# EAGLE design main_clock_board (EAGLE 8.2.1)
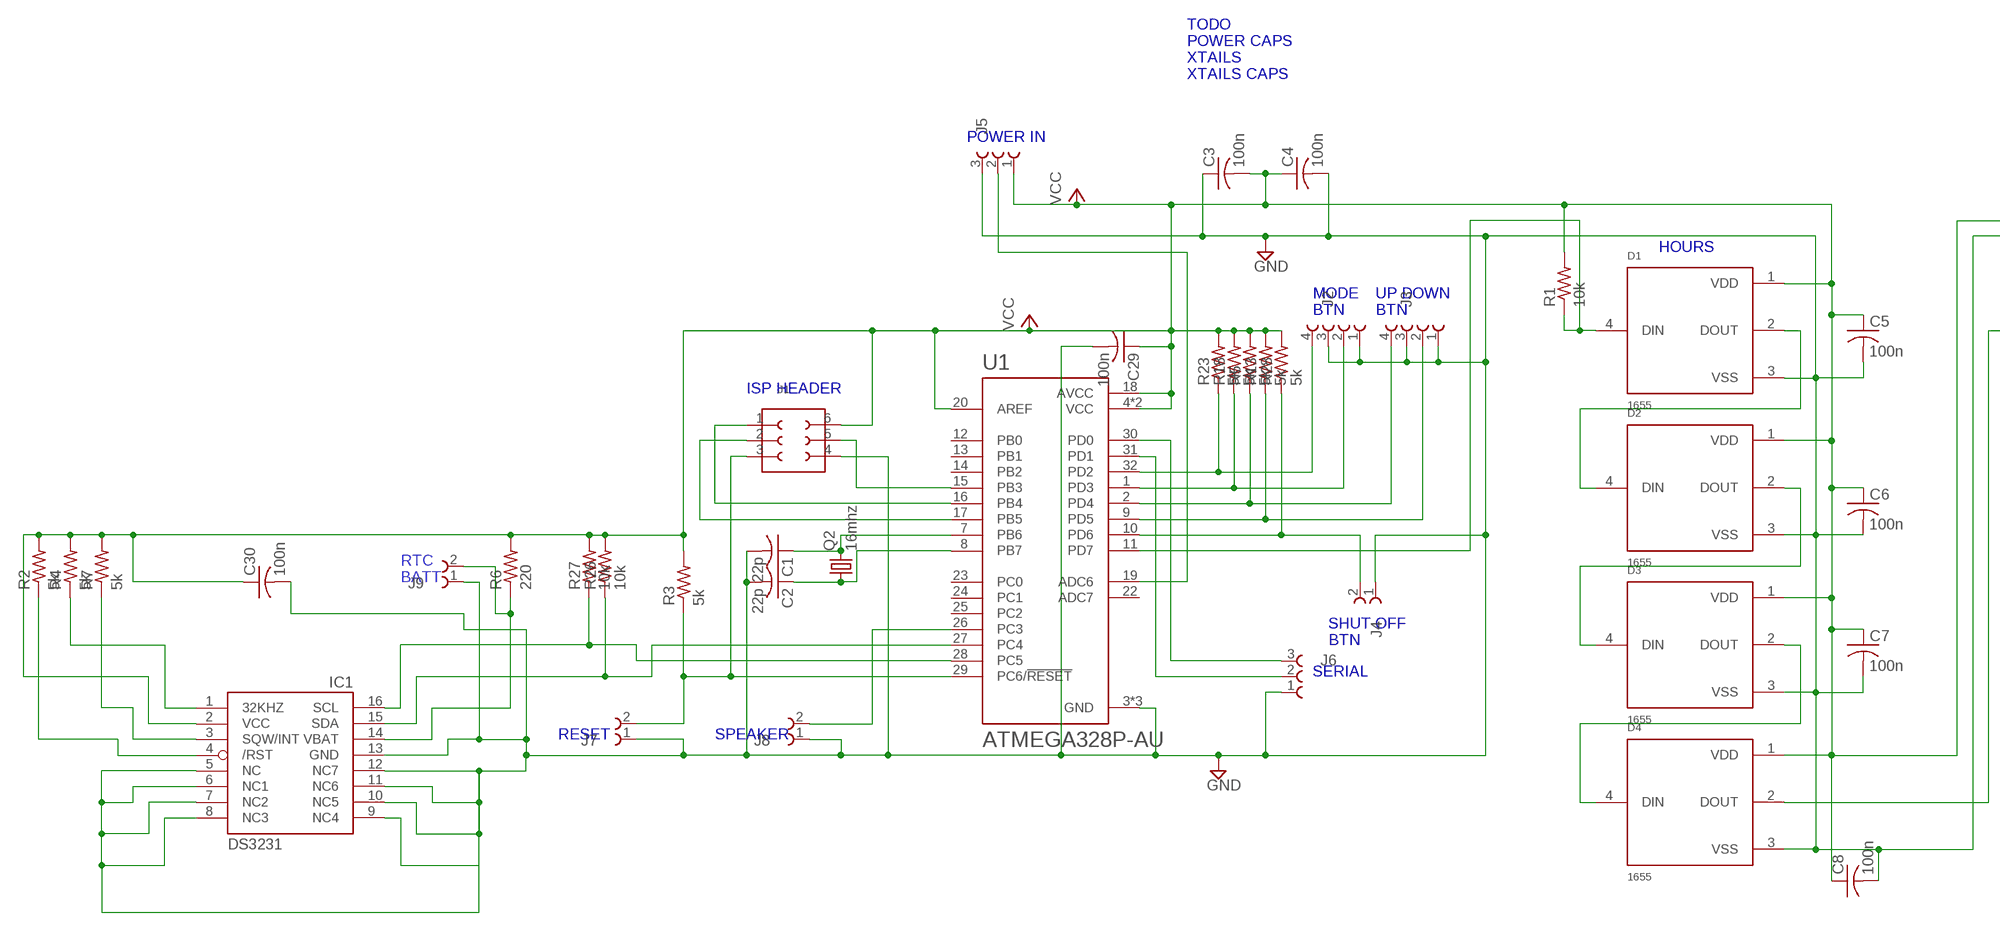
[diagram p0: schematic, sheet 1, part 1 of 2]
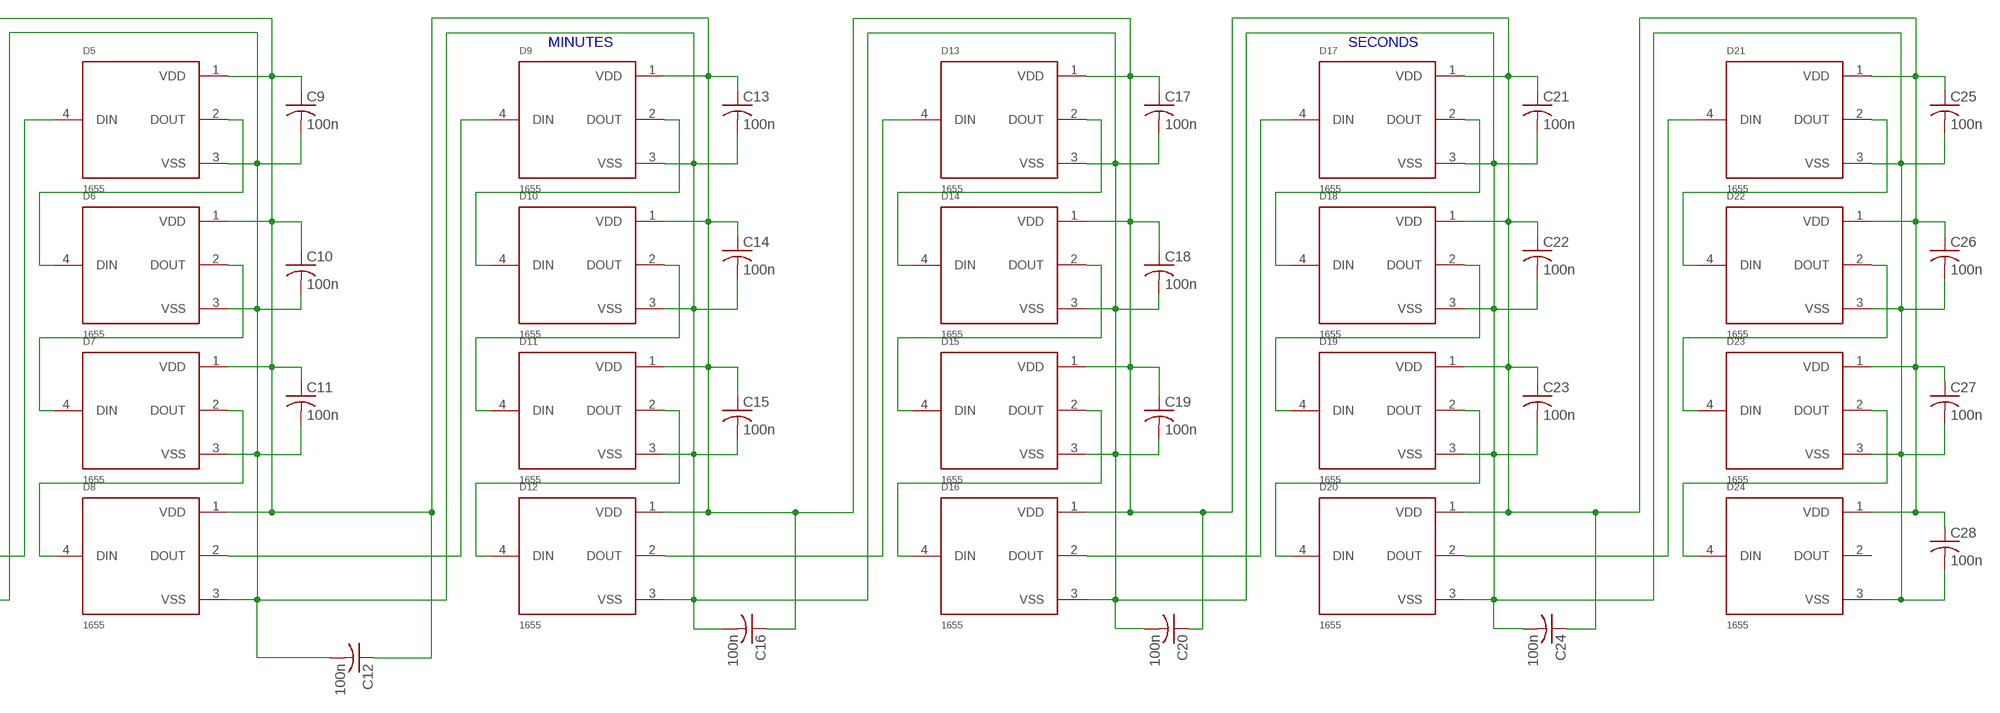
[diagram p1: schematic, sheet 1, part 2 of 2]

## Parts
C1  22p  C-USC0603  [C0603]
C2  22p  C-USC0603  [C0603]
C3  100n  C-US025-024X044  [C025-024X044]
C4  100n  C-US025-024X044  [C025-024X044]
C5  100n  C-US025-024X044  [C025-024X044]
C6  100n  C-US025-024X044  [C025-024X044]
C7  100n  C-US025-024X044  [C025-024X044]
C8  100n  C-US025-024X044  [C025-024X044]
C9  100n  C-US025-024X044  [C025-024X044]
C10  100n  C-US025-024X044  [C025-024X044]
C11  100n  C-US025-024X044  [C025-024X044]
C12  100n  C-US025-024X044  [C025-024X044]
C13  100n  C-US025-024X044  [C025-024X044]
C14  100n  C-US025-024X044  [C025-024X044]
C15  100n  C-US025-024X044  [C025-024X044]
C16  100n  C-US025-024X044  [C025-024X044]
C17  100n  C-US025-024X044  [C025-024X044]
C18  100n  C-US025-024X044  [C025-024X044]
C19  100n  C-US025-024X044  [C025-024X044]
C20  100n  C-US025-024X044  [C025-024X044]
C21  100n  C-US025-024X044  [C025-024X044]
C22  100n  C-US025-024X044  [C025-024X044]
C23  100n  C-US025-024X044  [C025-024X044]
C24  100n  C-US025-024X044  [C025-024X044]
C25  100n  C-US025-024X044  [C025-024X044]
C26  100n  C-US025-024X044  [C025-024X044]
C27  100n  C-US025-024X044  [C025-024X044]
C28  100n  C-US025-024X044  [C025-024X044]
C29  100n  C-US025-024X044  [C025-024X044]
C30  100n  C-US025-024X044  [C025-024X044]
D1  1655  [FCI_1655]
D2  1655  [FCI_1655]
D3  1655  [FCI_1655]
D4  1655  [FCI_1655]
D5  1655  [FCI_1655]
D6  1655  [FCI_1655]
D7  1655  [FCI_1655]
D8  1655  [FCI_1655]
D9  1655  [FCI_1655]
D10  1655  [FCI_1655]
D11  1655  [FCI_1655]
D12  1655  [FCI_1655]
D13  1655  [FCI_1655]
D14  1655  [FCI_1655]
D15  1655  [FCI_1655]
D16  1655  [FCI_1655]
D17  1655  [FCI_1655]
D18  1655  [FCI_1655]
D19  1655  [FCI_1655]
D20  1655  [FCI_1655]
D21  1655  [FCI_1655]
D22  1655  [FCI_1655]
D23  1655  [FCI_1655]
D24  1655  [FCI_1655]
IC1  DS3231/SO  [SO16W]
J1  610X0621121  [610X0621121]
J2  61300411121  [61300411121]
J3  61300411121  [61300411121]
J4  61300211121  [61300211121]
J5  61300311121  [61300311121]
J6  61300311121  [61300311121]
J7  61300211121  [61300211121]
J8  61300211121  [61300211121]
J9  61300211121  [61300211121]
Q2  16mhz  CRYSTALHC49S  [HC49/S]
R1  10k  R-US_R0603  [R0603]
R2  5k  R-US_R0603  [R0603]
R3  5k  R-US_R0603  [R0603]
R4  5k  R-US_R0603  [R0603]
R5  5k  R-US_R0603  [R0603]
R6  220  R-US_R0603  [R0603]
R7  5k  R-US_R0603  [R0603]
R13  5k  R-US_R0603  [R0603]
R18  5k  R-US_R0603  [R0603]
R23  5k  R-US_R0603  [R0603]
R26  10k  R-US_R0603  [R0603]
R27  10k  R-US_R0603  [R0603]
R28  5k  R-US_R0603  [R0603]
U1  ATMEGA328P-AU  [QFP80P900X900X120-32N]

## Nets
GND: C1.2 C2.2 C3.1 C4.2 C5.2 C6.2 C7.2 C8.2 C9.2 C10.2 C11.2 C12.2 C13.2 C14.2 C15.2 C16.2 C17.2 C18.2 C19.2 C20.2 C21.2 C22.2 C23.2 C24.2 C25.2 C26.2 C27.2 C28.2 C29.2 C30.2 D1.3(VSS) D2.3(VSS) D3.3(VSS) D4.3(VSS) D5.3(VSS) D6.3(VSS) D7.3(VSS) D8.3(VSS) D9.3(VSS) D10.3(VSS) D11.3(VSS) D12.3(VSS) D13.3(VSS) D14.3(VSS) D15.3(VSS) D16.3(VSS) D17.3(VSS) D18.3(VSS) D19.3(VSS) D20.3(VSS) D21.3(VSS) D22.3(VSS) D23.3(VSS) D24.3(VSS) IC1.5(NC) IC1.6(NC1) IC1.7(NC2) IC1.8(NC3) IC1.9(NC4) IC1.10(NC5) IC1.11(NC6) IC1.12(NC7) IC1.13(GND) J1.4 J2.1 J2.3 J3.1 J3.3 J4.1 J5.3 J6.1 J7.1 J8.1 J9.1 U1.3(GND) U1.5(GND) U1.21(GND)
N$1: D1.2(DOUT) D2.4(DIN)
N$2: IC1.15(SDA) R26.1 U1.27(PC4)
N$4: D2.2(DOUT) D3.4(DIN)
N$5: D3.2(DOUT) D4.4(DIN)
N$6: D4.2(DOUT) D5.4(DIN)
N$7: D5.2(DOUT) D6.4(DIN)
N$8: D6.2(DOUT) D7.4(DIN)
N$9: D7.2(DOUT) D8.4(DIN)
N$10: IC1.16(SCL) R27.1 U1.28(PC5)
N$11: J1.3 J7.2 R3.1 U1.29(PC6/!RESET)
N$12: D8.2(DOUT) D9.4(DIN)
N$13: D9.2(DOUT) D10.4(DIN)
N$14: J1.1 U1.16(PB4)
N$15: IC1.4(/RST) R2.1
N$16: D10.2(DOUT) D11.4(DIN)
N$17: D11.2(DOUT) D12.4(DIN)
N$18: D12.2(DOUT) D13.4(DIN)
N$19: D13.2(DOUT) D14.4(DIN)
N$20: D14.2(DOUT) D15.4(DIN)
N$21: D15.2(DOUT) D16.4(DIN)
N$23: J2.4 R23.1 U1.32(PD2)
N$24: D16.2(DOUT) D17.4(DIN)
N$25: D17.2(DOUT) D18.4(DIN)
N$26: J1.2 U1.17(PB5)
N$27: J2.2 R18.1 U1.1(PD3)
N$28: D18.2(DOUT) D19.4(DIN)
N$29: D19.2(DOUT) D20.4(DIN)
N$30: D20.2(DOUT) D21.4(DIN)
N$31: D21.2(DOUT) D22.4(DIN)
N$32: D22.2(DOUT) D23.4(DIN)
N$33: D23.2(DOUT) D24.4(DIN)
N$34: J3.4 R5.1 U1.2(PD4)
N$35: J3.2 R13.1 U1.9(PD5)
N$36: D1.4(DIN) R1.1 U1.11(PD7)
N$37: J4.2 R28.1 U1.10(PD6)
N$38: J1.5 U1.15(PB3)
N$39: J6.2 U1.31(PD1)
N$40: J6.3 U1.30(PD0)
N$41: J5.2 U1.19(ADC6)
N$42: J8.2 U1.26(PC3)
N$43: IC1.1(32KHZ) R4.1
N$44: IC1.14(VBAT) J9.2 R6.1
N$45: IC1.3(SQW/INT) R7.1
N$46: C1.1 Q2.2 U1.7(PB6)
N$47: C2.1 Q2.1 U1.8(PB7)
VCC: C3.2 C4.1 C5.1 C6.1 C7.1 C8.1 C9.1 C10.1 C11.1 C12.1 C13.1 C14.1 C15.1 C16.1 C17.1 C18.1 C19.1 C20.1 C21.1 C22.1 C23.1 C24.1 C25.1 C26.1 C27.1 C28.1 C29.1 C30.1 D1.1(VDD) D2.1(VDD) D3.1(VDD) D4.1(VDD) D5.1(VDD) D6.1(VDD) D7.1(VDD) D8.1(VDD) D9.1(VDD) D10.1(VDD) D11.1(VDD) D12.1(VDD) D13.1(VDD) D14.1(VDD) D15.1(VDD) D16.1(VDD) D17.1(VDD) D18.1(VDD) D19.1(VDD) D20.1(VDD) D21.1(VDD) D22.1(VDD) D23.1(VDD) D24.1(VDD) IC1.2(VCC) J1.6 J5.1 R1.2 R2.2 R3.2 R4.2 R5.2 R6.2 R7.2 R13.2 R18.2 R23.2 R26.2 R27.2 R28.2 U1.4(VCC) U1.6(VCC) U1.18(AVCC) U1.20(AREF)
Unconnected: D24.2(DOUT) U1.12(PB0) U1.13(PB1) U1.14(PB2) U1.22(ADC7) U1.23(PC0) U1.24(PC1) U1.25(PC2)

## Notes on the sheet
- TODO
  POWER CAPS
  XTAILS
  XTAILS CAPS
- POWER IN
- HOURS | MINUTES | SECONDS
- MODE
  BTN
- UP DOWN
  BTN
- ISP HEADER
- RTC
  BATT
- SHUT OFF
  BTN
- SERIAL
- RESET | SPEAKER

## Library data of the parts
C1-C30 = adafruit:C-US: CAPACITOR, American symbol
D1-D24 = 1655:1655: Ws2812b 5050 Rgb Led With Integrated Driver Chip Pack Of 10; AVAILABILITY: Good; DESCRIPTION: Ws2812b 5050 Rgb Led With Integrated Driver Chip Pack Of 10; MF: Adafruit Industries; MP: 1655; PACKAGE: None; PRICE: 4.16 USD
IC1 = DS3231_so16w:DS3231: The DS3231 is a low-cost, extremely accurate I²C real-time clock (RTC) with an integrated temperature-compensated crystal oscillator (TCXO) and crystal. The device incorporates a battery input, and maintains accurate timekeeping when main power to the device is interrupted.; AVAILABILITY: Unavailable; MF: Maxim Integrated; MP: DS3231; PACKAGE: None; PRICE: None
J1 = Wurth_Elektronik_Electromechanic_Board_to_Board_Connectors_rev16c:610X0621121: WR-PHD 2.54mm Dual SMT Pin Header, 6 Pins =>Code : Con_BTB_PHD_2.54_2_610x0621121(packageing:x = 0: Tube x = 3: Tape & Reel with Cap; 300 pcs/Reel) <http://katalog.we-online.de/media/images/eican/Con_BTB_PHD_2.54_2_6100xx21121_pf2.jpg> 6100xx21121 Details see: http://katalog.we-online.de/en/em/610_0xx_211_21 6103xx21121 Details see: http://katalog.we-online.de/en/em/PHD_2_54_SMT_DUAL_PIN_HEADER_REEL_6103XX21121 2014 (C) Würth Elektronik
J2 J3 = Wurth_Elektronik_Electromechanic_Board_to_Board_Connectors_rev16c:61300411121: WR-PHD 2.54mm Pin Header, 4 Pin =>Code : Con_BTB_PHD_2.54_1_THT_61300411121 <http://katalog.we-online.de/media/images/eican/Con_BTB_PHD_2.54_1_THT_6130xx11121_pf2.jpg> Details see: http://katalog.we-online.de/en/em/613_0xx_111_21 Created 2014-05-29, Karrer Zheng 2014 (C) Würth Elektronik
J4 J7-J9 = Wurth_Elektronik_Electromechanic_Board_to_Board_Connectors_rev16c:61300211121: WR-PHD 2.54mm Pin Header, 2 Pin=>Code : Con_BTB_PHD_2.54_1_THT_61300211121 <http://katalog.we-online.de/media/images/eican/Con_BTB_PHD_2.54_1_THT_6130xx11121_pf2.jpg> Details see: http://katalog.we-online.de/en/em/613_0xx_111_21 Created 2014-05-29, Karrer Zheng 2014 (C) Würth Elektronik
J5 J6 = Wurth_Elektronik_Electromechanic_Board_to_Board_Connectors_rev16c:61300311121: WR-PHD 5.54mm Pin Header, 3 Pin =>Code : Con_BTB_PHD_2.54_1_THT_61300311121 <http://katalog.we-online.de/media/images/eican/Con_BTB_PHD_2.54_1_THT_6130xx11121_pf2.jpg> Details see: http://katalog.we-online.de/en/em/613_0xx_111_21 Created 2014-05-29, Karrer Zheng 2014 (C) Würth Elektronik
Q2 = adafruit:CRYSTAL: CRYSTAL; OC_FARNELL: 1667008; OC_NEWARK: unknown
R1-R7 R13 R18 R23 R26-R28 = adafruit:R-US_: RESISTOR, American symbol
U1 = ATMEGA328P-AU:ATMEGA328P-AU: ATmega Series 20 MHz 32 KB Flash 2 KB SRAM 8-Bit Microcontroller - TQFP-32; AVAILABILITY: Good; DESCRIPTION: ATmega Series 20 MHz 32 KB Flash 2 KB SRAM 8-Bit Microcontroller - TQFP-32; MF: Atmel; MP: ATMEGA328P-AU; PACKAGE: TQFP-32 Atmel; PRICE: 2.48 USD

## Board
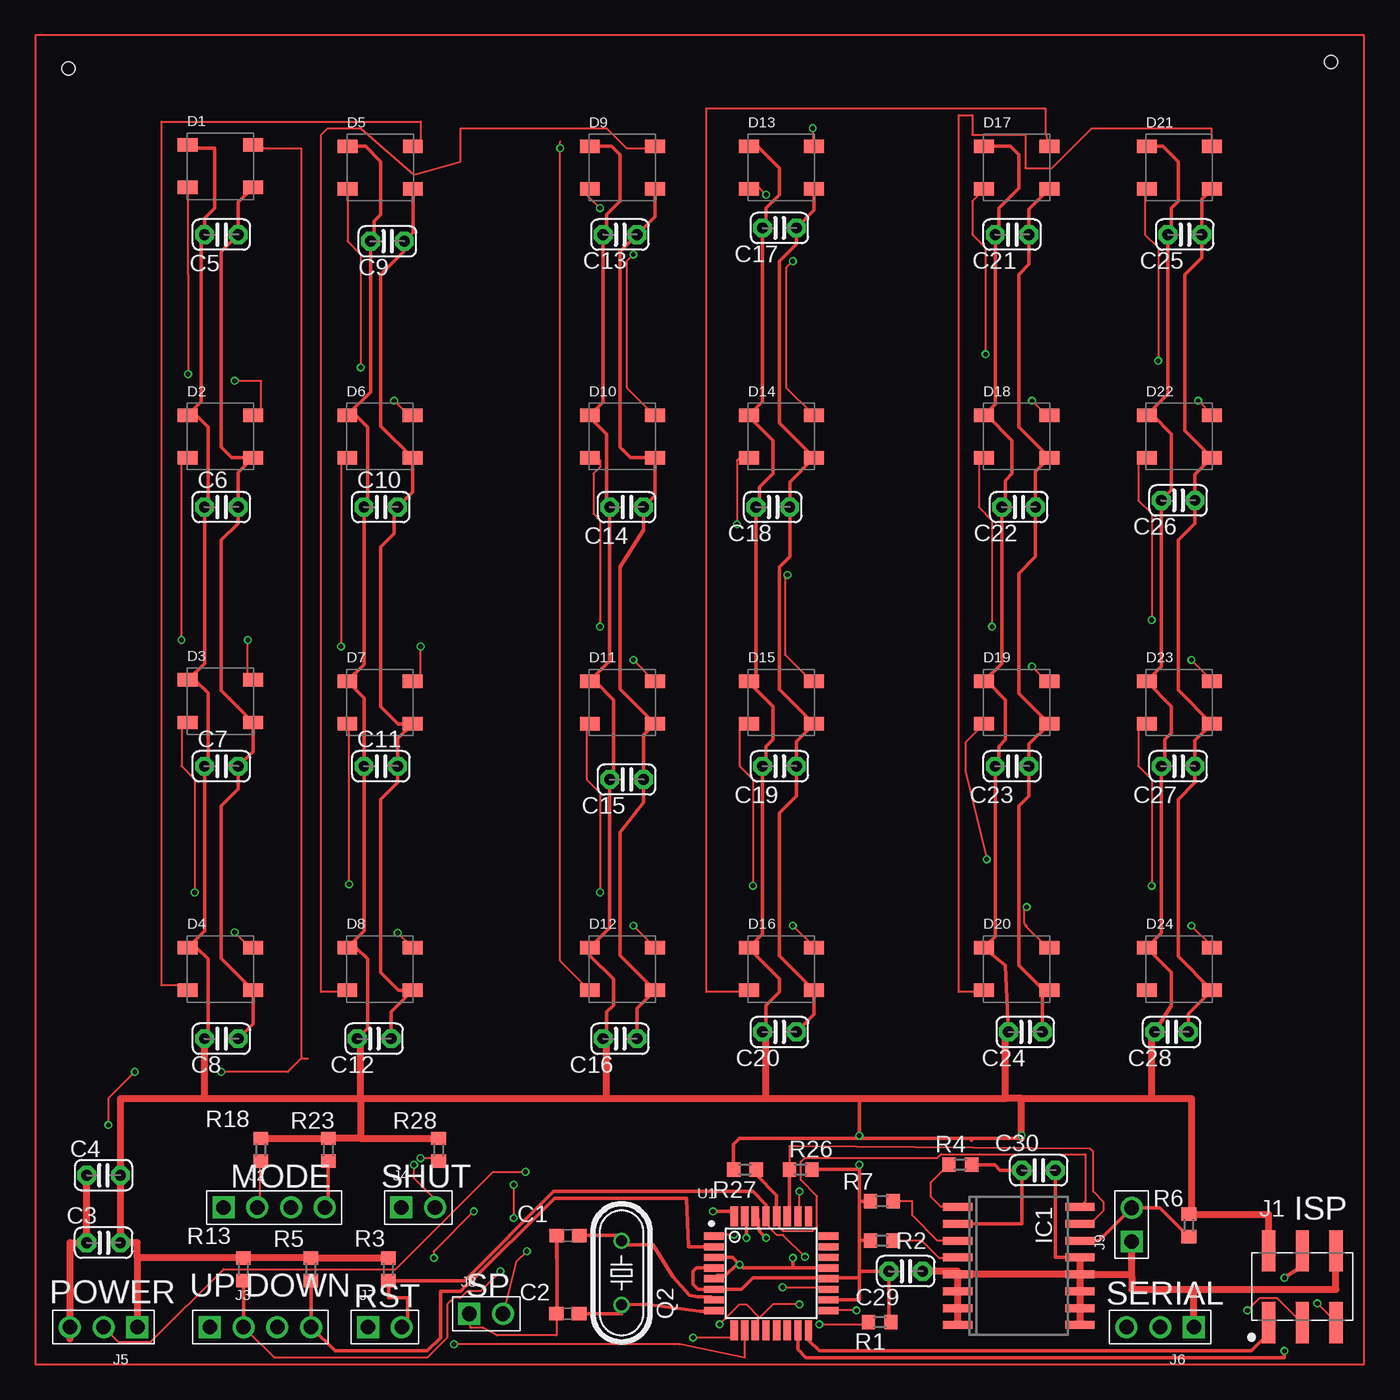
[diagram p2: board, top side]
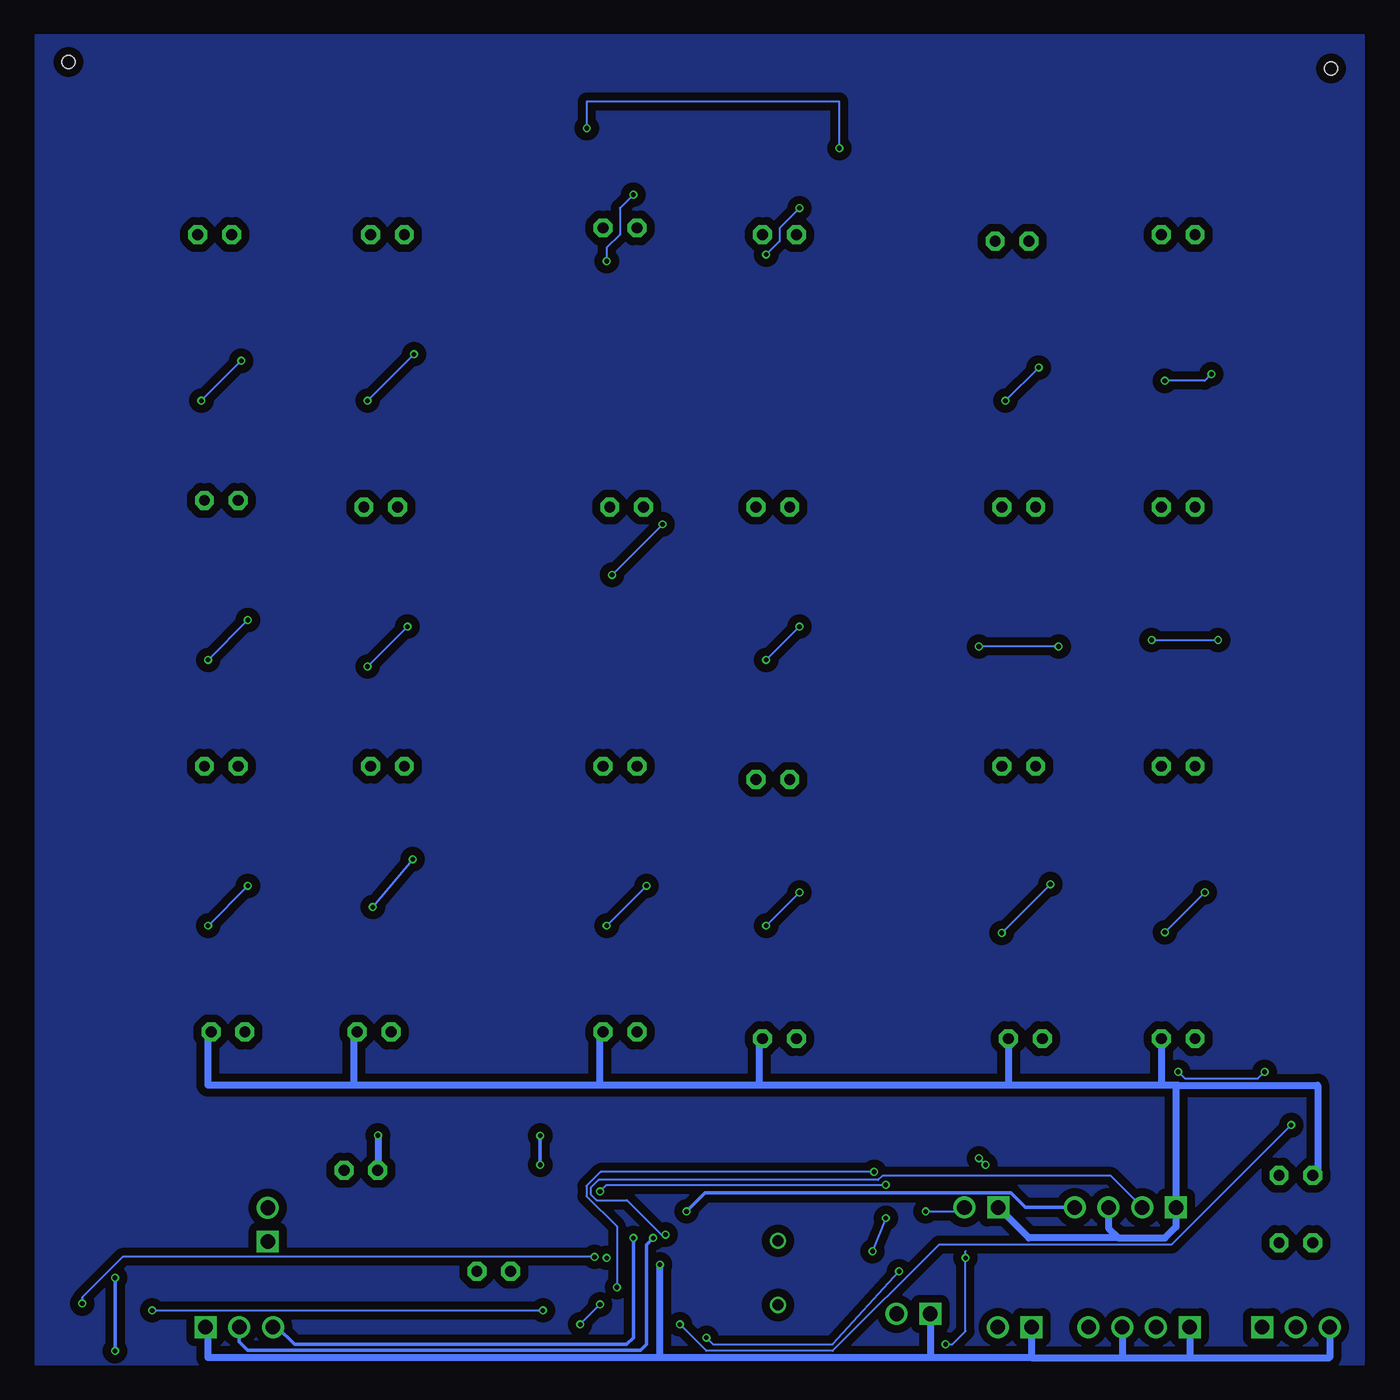
[diagram p3: board, bottom side, seen from below]

No outline drawn. Coordinates in mm, seen from the top.
Copper layers (1*16): Top 0.018mm / dielectric 1.55mm / Bottom 0.018mm
Design rules "eC_2Layer_PClass6_BaseCopperO18_eCDefault": minimum track width 0.15mm, minimum drill 0.35mm, track to track 0.15mm, track to pad 0.15mm, pad to pad 0.15mm, via to via 0.15mm, smd to smd 0mil, copper to edge 0.25mm, drill to drill 0.35mm, minimum pad ring 0.175mm, minimum via ring 0.125mm, stop-mask expansion 0mil, vias tented up to drill 0.45mm, thermal gap 0.2mm
Holes 1 mm at 2.5,97.5 97.5,98

### Footprints (pad centres in the part's own frame; a part is rotated, then mirrored left to right if it is on the bottom)
C0603 = smd 1.1 x 1: 1 -0.85,0; 2 0.85,0
C025-024X044 = drill 0.813 pad 1.422 octagon: 1 -1.27,0; 2 1.27,0
FCI_1655 = smd 1.5 x 1: 1 -2.45,1.6; 2 -2.45,-1.6; 3 2.45,-1.6; 4 2.45,1.6
SO16W = smd 0.6 x 2.2: 1 -4.445,-4.6; 2 -3.175,-4.6; 3 -1.905,-4.6; 4 -0.635,-4.6; 5 0.635,-4.6; 6 1.905,-4.6; 7 3.175,-4.6; 8 4.445,-4.6; 9 4.445,4.6; 10 3.175,4.6; 11 1.905,4.6; 12 0.635,4.6; 13 -0.635,4.6; 14 -1.905,4.6; 15 -3.175,4.6; 16 -4.445,4.6
610X0621121 = smd 1 x 3.1: 1 -2.54,-2.7; 2 0,-2.7; 3 2.54,-2.7; 4 2.54,2.7; 5 0,2.7; 6 -2.54,2.7
61300411121 = drill 1.1 square: 1 -3.81,0 | drill 1.1: 2 -1.27,0; 3 1.27,0; 4 3.81,0
61300211121 = drill 1.1 square: 1 -1.27,0 | drill 1.1: 2 1.27,0
61300311121 = drill 1.1 square: 1 -2.54,0 | drill 1.1: 2 0,0; 3 2.54,0
HC49/S = drill 0.813: 1 -2.413,0; 2 2.413,0
R0603 = smd 1 x 1.1: 1 -0.85,0; 2 0.85,0
QFP80P900X900X120-32N = smd 1.5 x 0.55: 1 -4.3,2.8; 2 -4.3,2; 3 -4.3,1.2; 4 -4.3,0.4; 5 -4.3,-0.4; 6 -4.3,-1.2; 7 -4.3,-2; 8 -4.3,-2.8; 17 4.3,-2.8; 18 4.3,-2; 19 4.3,-1.2; 20 4.3,-0.4; 21 4.3,0.4; 22 4.3,1.2; 23 4.3,2; 24 4.3,2.8 | smd 0.55 x 1.5: 9 -2.8,-4.3; 10 -2,-4.3; 11 -1.2,-4.3; 12 -0.4,-4.3; 13 0.4,-4.3; 14 1.2,-4.3; 15 2,-4.3; 16 2.8,-4.3; 25 2.8,4.3; 26 2,4.3; 27 1.2,4.3; 28 0.4,4.3; 29 -0.4,4.3; 30 -1.2,4.3; 31 -2,4.3; 32 -2.8,4.3

### Placement (x,y rotation side)
C1  40.08,9.69 180 top
C2  40.07,3.81 180 top
C3  5.14,9.14 0 top
C4  5.14,14.22 180 top
C5  14,85 0 top
C6  14,64.5 0 top
C7  14,45 0 top
C8  14,24.5 0 top
C9  26.5,84.5 0 top
C10  26,64.5 0 top
C11  26,45 0 top
C12  25.5,24.5 0 top
C13  44,85 0 top
C14  44.5,64.5 0 top
C15  44.5,44 0 top
C16  44,24.5 0 top
C17  56,85.5 0 top
C18  55.5,64.5 0 top
C19  56,45 0 top
C20  56,25 0 top
C21  73.5,85 0 top
C22  74,64.5 0 top
C23  73.5,45 0 top
C24  74.5,25 0 top
C25  86.5,85 0 top
C26  86,65 0 top
C27  86,45 0 top
C28  85.5,25 0 top
C29  65.5,7 0 top
C30  75.5,14.6 0 top
D1  13.93,90.14 0 top
D2  13.93,69.8 0 top
D3  13.93,49.89 0 top
D4  13.93,29.74 0 top
D5  25.96,90.04 0 top
D6  25.93,69.8 0 top
D7  25.93,49.79 0 top
D8  25.93,29.74 0 top
D9  44.17,90.04 0 top
D10  44.17,69.8 0 top
D11  44.17,49.79 0 top
D12  44.17,29.74 0 top
D13  56.14,90.04 0 top
D14  56.14,69.8 0 top
D15  56.14,49.79 0 top
D16  56.14,29.74 0 top
D17  73.84,90.04 0 top
D18  73.84,69.8 0 top
D19  73.84,49.79 0 top
D20  73.84,29.74 0 top
D21  86.08,90.04 0 top
D22  86.08,69.8 0 top
D23  86.08,49.79 0 top
D24  86.08,29.74 0 top
IC1  74,7.4 270 top
J1  95.33,5.84 0 top
J2  17.97,11.79 0 top
J3  16.94,2.79 0 top
J4  28.81,11.79 0 top
J5  5.14,2.79 180 top
J6  84.64,2.79 180 top
J7  26.3,2.79 0 top
J8  33.92,3.79 0 top
J9  82.5,10.5 90 top
Q2  44.11,6.88 90 top
R1  63.54,3.16 0 top
R2  63.7,9.31 180 top
R3  26.57,7.14 90 top
R4  69.6,15.03 0 top
R5  20.75,7.14 90 top
R6  86.8,10.45 90 top
R7  63.7,12.27 180 top
R13  15.67,7.14 90 top
R18  16.97,16.14 90 top
R23  22.05,16.14 90 top
R26  57.59,14.65 0 top
R27  53.4,14.65 180 top
R28  30.35,16.14 90 top
U1  55.38,6.84 0 top

### Tracks (layer width: path | path; a pad name or v marks a point on that pad's centre or on a via)
GND  (via drill 0.35)
  Top 0.152: C2.2 39.29,3.89 39.29,9.68 C1.2 39.13,9.83 39.21,2.18 34.75,2.18 33.68,2.74 32.77,2.74 J8.1
  Top 0.254: D1.3 15.27,87.43 C5.2 14,83.73 14,69 14.8,68.2 D2.3 15.27,67.09 C6.2 15.27,63.27 14,62 14,50.68 D3.3 16.38,46.11 C7.2 15.27,43.27 14,42 14,30.53 D4.3 16.38,25.61 C8.2 | D5.3 28.41,85.14 C9.2 27.77,83.77 26,82 26,70.59 D6.3 28.38,65.61 C10.2 27,64.23 27,62.5 26,61.5 26,49.5 27.31,48.19 D7.3 27.27,47.08 C11.2 27.27,43.77 26,42.5 26,29.5 27.36,28.14 D8.3 26.77,26.53 C12.2 | D9.3 46.62,86.35 C13.2 44,83.73 44,69 44.8,68.2 D10.3 46.62,65.35 C14.2 45.77,62.77 44,60 44,50.82 D11.3 45.77,47.34 C15.2 45.77,42.27 44,40 44,30.77 D12.3 45.27,26.79 C16.2 | D13.3 58.59,86.82 C17.2 57.27,84.27 56,83 56,70.8 D14.3 56.77,66.38 C18.2 56.77,60.77 56,60 56,50.79 D15.3 57.27,46.87 C19.2 57.27,42.77 56,41.5 56,30.74 D16.3 58.59,26.32 C20.2 | C24.2 75.77,27.62 76.08,27.93 | 76.08,27.93 D20.3 | C28.2 86.77,26.38 D24.3 86,30.68 86,42.5 87.27,43.77 C27.2 87.27,46.93 D23.3 86,50.73 86,62 87.27,63.27 C26.2 87.27,66.94 D22.3 86.5,70.24 86.5,82 87.77,83.27 C25.2 87.77,87.68 D21.3 | D17.3 74.77,86.92 C21.2 74.77,82.77 74,82 74,70.5 D18.3 75.27,67.18 C22.2 75.27,60.77 74,59.5 74,50.49 D19.3 74.77,46.67 C23.2 74.77,42.77 74,42 74,30 76.08,27.93 | v53,7.5 52.46,8.04 U1.3 | U1.5 51.33,6.69 51.95,6.69 52.76,7.5 v53,7.5 | v53,7.5 53.26,7.24 57,7.24 | 57,7.24 U1.21 | v57,8 57,7.24 | IC1.13 76.77,8.04 C30.2
  Top 0.508: C4.2 C3.1 2.6,9.14 J5.3 2.6,1.9 | 87.18,5.63 82.5,5.63 82.5,6.6 | 82.5,6.6 J9.1 | J6.1 87.18,5.63 | 87.18,5.63 97.87,5.63 J1.4 | IC1.12 IC1.5 | IC1.12 82.33,6.76 82.5,6.6 | IC1.13 IC1.12 | IC1.12 IC1.11 IC1.10 IC1.9 | IC1.5 IC1.6 IC1.7 IC1.8 | IC1.5 69.4,7 C29.2
  Bottom 0.508: C8.2 15.27,21 | 15.27,21 26.77,21 | C12.2 26.77,21 | 26.77,21 45.5,21 | 45.5,21 45.5,24.5 C16.2 | 45.5,21 57.5,21 | 57.5,21 57.5,25 C20.2 | 57.5,21 76,21 | 76,21 76,25 C24.2 | 76,21 87,21 87,25 C28.2 86.5,25 | 14,21 15.27,21 | 14,21 3.5,21 3.5,14.22 C4.2 | 14,21 14.16,20.84 J2.1 14.16,10.34 15,9.5 18.5,9.5 | J2.3 19.24,10.24 18.5,9.5 | 18.5,9.5 25.25,9.5 J4.1 | J5.3 2.6,0.5 13.13,0.5 | J6.1 87,2.79 87,0.5 53,0.5 | 18.21,0.5 13.13,0.5 | 25.03,0.5 18.21,0.5 | 25.03,0.5 32.65,0.5 | J3.1 13.13,0.5 | J3.3 18.21,0.5 | J7.1 25.03,0.5 | J8.1 32.65,0.5 | 53,0.5 v53,7.5 | 32.65,0.5 53,0.5
N$1  (via drill 0.35)
  Top 0.152: D1.2 11.48,82.02 11.5,82 v11.5,74.5 | v15,74 17,74 17,71.5 16.5,71 D2.4
  Bottom 0.152: v15,74 12,74 v11.5,74.5
N$2
  Top 0.152: IC1.15 79.38,10.57 80.4,11.6 80.4,12.2 79.6,13 79.6,16 79.4,16.2 57.4,16.4 57.24,16.4 56.74,16.4 R26.1
  Top 0.254: R26.1 56.74,11.3 U1.27
N$3
  Top 0.152: 100,0 100,100 0,100 0,0 100,0
N$4  (via drill 0.35)
  Top 0.152: D2.2 11,68 v11,54.5 | v16,54.5 16,51.5 D3.4
  Bottom 0.152: v16,54.5 v11,54.5
N$5  (via drill 0.35)
  Top 0.152: v15,32.5 16,31.5 D4.4 | v12,35.5 12,44 11,45 11,48 D3.2
  Bottom 0.152: v12,35.5 v15,32.5
N$6
  Top 0.152: D4.2 11.48,28.5 9.5,28.5 9.5,93.5 29,93.5 29,91.64 D5.4
N$7  (via drill 0.35)
  Top 0.152: v27,72.5 28,71.5 D6.4 | v24.5,75 24.5,83.5 23.5,84.5 23.5,88 D5.2
  Bottom 0.152: v24.5,75 v27,72.5
N$8  (via drill 0.35)
  Top 0.152: v23,54 23,68 D6.2 | v29,54 29,51.5 28.5,51 D7.4
  Bottom 0.152: v23,54 v29,54
N$9  (via drill 0.35)
  Top 0.152: v23.62,36.12 23.62,48.16 D7.2 | v27.28,32.46 28.35,31.39 D8.4
  Bottom 0.152: v27.28,32.46 v23.62,36.12
N$10
  Top 0.152: U1.28 55.93,11.12 55.93,10.36 56.24,10.06 58.52,10.06 58.83,10.36 58.83,12.65 57.61,13.87 57.61,15.24 57.91,15.54 67.89,15.54 68.16,15.81 71.04,15.81 71.05,15.8 79,15.8 79,12.24 IC1.16
  Top 0.254: R27.1 54.25,14.25 55.78,12.72 U1.28
N$11  (via drill 0.35)
  Top 0.152: v96.47,4.57 97.84,3.2 J1.3 | v57.91,8.08 56.24,9.75 55.78,9.75 55.02,10.52 55.02,11.12 U1.29
  Top 0.254: J7.2 28,2.79 28,5 26.57,5 R3.1 32.29,6.29 39,13 54,13 55,12 55,11.16 U1.29
  Bottom 0.152: v96.47,4.57 96.47,5.03 93.42,8.08 v57.91,8.08
N$12
  Top 0.152: D8.2 23.48,28 21.5,28 21.5,92.5 22,93 24.5,93 28.5,89.5 32,90.5 32,93 43,93 44.5,91.5 46.5,91.5 D9.4
N$13  (via drill 0.35)
  Top 0.152: v45,83.5 44.5,83 44.5,73.5 46.5,71.5 D10.4 | v42.5,87 41.5,88 D9.2
  Bottom 0.152: v45,83.5 44,84.5 44,85.5 v42.5,87
N$14
  Top 0.254: U1.16 58.18,1.82 59,1 91.5,1 93,2.5 93,2.94 J1.1
N$15
  Top 0.152: R2.1 66.69,9.31 68,8 69.36,8 IC1.4
N$16  (via drill 0.35)
  Top 0.152: v45,53 46.5,51.5 D11.4 | v42.5,55.5 42.5,63.5 42,64 42,67 42.5,67.5 42.5,68 42,68.5 D10.2
  Bottom 0.152: v42.5,55.5 v45,53
N$17  (via drill 0.35)
  Top 0.152: v45,33 46.5,31.5 D12.4 | v42.5,35.5 42.5,43 41.5,44 41.5,48 D11.2
  Bottom 0.152: v42.5,35.5 v45,33
N$18  (via drill 0.35)
  Top 0.152: D13.4 58.5,91.5 v58.5,93 | D12.2 39.5,30.37 v39.5,91.5 39.5,92
  Bottom 0.152: v58.5,93 58.5,95 39.5,95 v39.5,91.5
N$19  (via drill 0.35)
  Top 0.152: v57,83 56.5,82.5 56.5,73.5 58.5,71.5 D14.4 | v55,88 54.5,88.5 54,88.5 D13.2
  Bottom 0.152: v57,83 57,84 56,85 56,87 v55,88
N$20  (via drill 0.35)
  Top 0.152: v56.6,59.4 56.4,59.2 56.4,53.4 58.4,51.4 D15.4 | v52.8,63.2 52.8,68 53,68.2 53.6,68.2 D14.2
  Bottom 0.152: v52.8,63.2 v56.6,59.4
N$21  (via drill 0.35)
  Top 0.152: v57,33 58.5,31.5 D16.4 | v54,36 54,44 53,45 53,48 53.5,48.5 D15.2
  Bottom 0.152: v54,36 v57,33
N$23  (via drill 0.35)
  Top 0.254: R23.1 22.05,11.79 J2.4 | U1.32 52.23,11.5 v51,11.5
  Bottom 0.254: J2.4 25.5,11.79 26.6,12.9 49.6,12.9 v51,11.5
N$24
  Top 0.152: 54,28.5 D16.2 53.69,28 50.5,28 50.5,94.5 76,94.5 76,92.64 D17.4 76,91.5
N$25  (via drill 0.35)
  Top 0.152: v75,72.5 76,71.5 D18.4 | v71.5,76 71.5,84 70.5,85 70.5,87.5 71,88 D17.2
  Bottom 0.152: v71.5,76 v75,72.5
N$26  (via drill 0.35)
  Top 0.15: v61.8,4.05 59.7,4.05 U1.17 | v91.2,4.05 92.1,4.95 93.45,4.95 95.25,3.15 J1.2
  Bottom 0.15: v91.2,4.05 v61.8,4.05
N$27  (via drill 0.35)
  Top 0.152: R18.1 16.92,15.24 16.92,12.04 16.76,11.89 J2.2 | v52.58,9.75 51.21,9.75 U1.1
  Bottom 0.152: v52.58,9.75 52.88,9.75 55.47,12.34 57.76,12.34 58.22,12.8 58.22,13.26 57.61,13.87 36.58,13.87 36.27,14.17 19.05,14.17 16.76,11.89 J2.2
N$28  (via drill 0.35)
  Top 0.152: v75,52.5 76,51.5 D19.4 | v72,55.5 72,63.5 71,64.5 71,68 D18.2
  Bottom 0.152: v72,55.5 v75,52.5
N$29  (via drill 0.35)
  Top 0.152: 74.5,33 74.55,32.95 | 74.55,32.95 76,31.5 D20.4 | v74.6,34.4 74.4,34.2 74.4,33.2 74.6,33 74.55,32.95 | v71.6,38 70,44.6 70,46.8 D19.2
  Bottom 0.152: v71.6,38 v74.6,34.4
N$30
  Top 0.152: D20.2 71.39,28 69.5,28 69.5,94 70.5,94 70.5,92.5 74.5,92.5 74.5,90 76.5,90 79.5,93 88.5,93 88.5,91.64 D21.4
N$31  (via drill 0.35)
  Top 0.152: v87.5,72.5 88.5,71.5 D22.4 | v84.5,75.5 84.5,84 83.5,85 83.5,88 D21.2
  Bottom 0.152: v84.5,75.5 v87.5,72.5
N$32  (via drill 0.35)
  Top 0.152: v87,53 88.5,51.5 D23.4 | v84,56 84,64 83,65 83,68 83.5,68.5 D22.2
  Bottom 0.152: v84,56 v87,53
N$33  (via drill 0.35)
  Top 0.152: v87,33 88.5,31.5 D24.4 | v84,36 84,44 83,45 83,48 83.5,48.5 D23.2
  Bottom 0.152: v84,36 v87,33
N$34
  Top 0.254: R5.1 J3.4 22.55,1 29.5,1 30.5,2 30.5,5.5 32,5.5 32.39,5.89 32.46,5.89 39.08,12.5 49,12.5 49.16,8.84 U1.2
N$35  (via drill 0.35)
  Top 0.152: v35,7 33.5,5.5 32.5,5.5 32,5 31.5,5 31,4.5 31,2 29.5,0.5 18,0.5 16,2.5 J3.2 | v49.5,2 52.5,2 52.5,2.5 U1.9
  Top 0.254: R13.1 J3.2
  Bottom 0.152: v35,7 40,1.5 49,1.5 v49.5,2
N$36  (via drill 0.35)
  Top 0.152: 54.5,3.5 55.5,4.5 v57.5,4.5 | 54.5,3.5 54,3 U1.11 | D1.4 16.5,91.5 20,91.5 20,23 | 54.5,3.5 53.5,4.5 53,4.5 v51.5,3 | v5.5,18 5.5,20 v7.5,22 | v14,22 19,22 20,23 | 20,23 20.5,23 | v59,3 62.5,3 R1.1
  Bottom 0.152: v59,3 v57.5,4.5 | v51.5,3 49.5,1 40,1 32,9 14.5,9 v5.5,18 | v7.5,22 8,21.5 13.5,21.5 v14,22
N$37  (via drill 0.35)
  Top 0.152: U1.10 53.38,0.5 48.5,1.5 v31.5,1.5 | v33,11.5 30,8.5 v30,8 | v28.5,15 28.5,14 30.5,12 J4.2 | v29,15.5 30,15.5 R28.1
  Bottom 0.152: v31.5,1.5 31,1.5 30,2.5 v30,8 30,8.5 | v33,11.5 30.5,11.5 J4.2 | v29,15.5 v28.5,15
N$38  (via drill 0.35)
  Top 0.254: U1.15 57.38,1.12 58,0.5 94,0.5 v94,1 | v94,6.5 95.5,7.5 95.5,8.5 J1.5
  Bottom 0.254: v94,1 v94,6.5
N$39  (via drill 0.35)
  Top 0.254: U1.31 53.5,11.03 v53.5,9.5
  Bottom 0.254: v53.5,9.5 54,9 54,1.5 54.47,1.03 84,1.03 84.64,1.68 J6.2
N$40  (via drill 0.35)
  Top 0.254: U1.30 54.43,10.9 54.43,10.28 54.5,10.21 54.5,10 v55,9.5
  Bottom 0.254: v55,9.5 55,2 55.5,1.5 80.5,1.5 81.79,2.79 J6.3
N$41  (via drill 0.35)
  Top 0.152: v56.24,5.79 59.59,5.79 U1.19 | v36.88,14.48 34.44,14.48 27.13,7.16 14.17,7.16 8.69,1.68 6.25,1.68 5.18,2.74 J5.2
  Bottom 0.152: v56.24,5.79 56.24,10.36 58.52,12.65 58.52,13.41 57.45,14.48 v36.88,14.48
N$42  (via drill 0.35)
  Top 0.152: U1.26 57.5,11.26 v57.5,13 | v36,13.5 v36,11 | v37,8.5 36.19,7.69 J8.2
  Bottom 0.152: v57.5,13 57,13.5 v36,13.5 | v36,11 v37,8.5
N$43
  Top 0.152: R4.1 67.4,13.68 67.4,12.6 68.16,11.85 IC1.1
N$44
  Top 0.254: IC1.14 80.03,9.3 J9.2 84.63,11.77 R6.1
N$45
  Top 0.152: IC1.3 67.89,9.3 66,11.2 66,12.27 R7.1
N$46
  Top 0.254: C1.1 44.11,9.69 Q2.2 44.11,9 46.5,9 48,6.58 49.23,5.21 49.84,5.09 50.84,5.09 U1.7
N$47
  Top 0.254: U1.8 51.04,4 50,4 46,4.5 44,4.46 Q2.1 44.11,3.81 C2.1
VCC  (via drill 0.35)
  Top 0.15: 68.85,10.65 69.3,10.65 IC1.2
  Top 0.152: 62,5.77 62,5.5
  Top 0.254: D1.1 11.73,91.5 13.5,91.5 13.5,87 12.73,86.23 C5.1 12.5,84.77 12.5,72.42 D2.1 12.1,71.4 13,70.5 13,64.77 C6.1 12.73,52.74 D3.1 12.01,51.49 13,50.5 13,45.27 C7.1 12.73,32.59 D4.1 12.16,31.34 13,30.5 13,24.77 C8.1 | D5.1 24.86,91.64 26,90.5 26,86.5 25.5,86 25.5,84.77 C9.1 25.23,73.15 D6.1 24.1,71.4 25,70.5 25,64.77 C10.1 24.73,52.64 D7.1 24.73,50.15 C11.1 24.73,32.59 D8.1 24.16,31.34 25,30.5 25,25.27 C12.1 | D9.1 43.36,91.64 44,91 44,87.5 43,86.5 43,85.27 C13.1 42.73,72.41 D10.1 41.72,71.28 43,70 43,64.73 C14.1 43.23,52.9 D11.1 42.11,51.39 43.5,50 43.5,44.27 C15.1 43.23,32.85 D12.1 41.72,30.78 43.5,29 43.5,27 43,26.5 43,24.77 C16.1 | D13.1 54.36,91.64 56,90 56,88 55,87 55,85.77 C17.1 54.73,72.44 D14.1 53.69,71.31 55.5,69.5 55.5,67 54.5,66 54.5,64.77 C18.1 54.23,51.93 D15.1 53.69,51.31 55.5,49.5 55.5,47 55,46.5 55,45.27 C19.1 54.73,32.38 D16.1 53.69,31.31 56,29 56,28 55,27 55,25.27 C20.1 | D17.1 73.36,91.64 74,91 74,88.5 72.5,87 72.5,85.27 C21.1 72.23,72.24 D18.1 71.6,71.4 73.5,69.5 73.5,67 73,66.5 73,64.77 C22.1 72.73,52.73 D19.1 71.61,51.39 73,50 73,47 72.5,46.5 72.5,45.27 C23.1 72.23,32.18 D20.1 73,30 C24.1 | D21.1 84.86,91.64 86,90.5 86,87.5 85.5,87 85.5,85.27 C25.1 85.23,73 D22.1 84.1,71.4 85.5,70 85.5,65.77 C26.1 84.73,52.49 D23.1 83.63,51.37 85.5,49.5 85.5,47.5 85,47 85,45.27 C27.1 84.73,32.44 D24.1 85.5,29.5 85.5,27 C28.1 | 92.79,11.3 87,11.3 R6.2 | 92.79,9.6 J1.6 | 62,14.65 R26.2 | 59.68,6.5 62,6.5 | 59.68,6.5 U1.20 | 62,6.5 62,5.5 62,4.84 U1.18 | 62,6.5 62,7 | 62,12.27 62,14.6 62,14.65 | 62,9.31 62,12.27 | 62,9.31 62,7
  Top 0.254: 59.68,6.5 54,6.5 53.14,5.64 U1.6 49.86,5.64 49.5,6 49.5,7 49.74,7.24 U1.4 | 70.6,17 53,17 52.55,16.55 R27.2 | 70.6,17 74.22,17 | C30.1 74.18,14.65 | 70.45,16.85 70.6,17 | R7.2 62,12.27 | R2.2 62,9.31 | C30.1 72.6,14.6 72.2,15 70.48,15 R4.2 | IC1.2 74.23,10.57 C30.1 | R1.2 64.23,3.16 C29.1 62,7 | v62,17.2 62,20 | 62,14.65 v62,15
  Top 0.508: 12.73,20 C8.1 | 12.73,20 24.5,20 | 24.5,20 24.5,24.5 C12.1 | 24.5,20 43,20 | 43,20 43,24.5 C16.1 | 43,20 55,20 | 55,20 55,25 C20.1 | 55,20 62,20 73,20 | 73,20 73,25 C24.1 | 74.22,20 73,20 | 74.22,20 84,20 | 84,20 84,25 C28.1 | 7.68,8 J5.1 | 7.68,8 7.68,9.14 C3.2 C4.1 6.41,20 12.73,20 | R18.2 R23.2 24.5,16.99 | 24.5,16.99 R28.2 | 24.5,20 24.5,16.99 | R3.2 R5.2 R13.2 7.68,8 | 84,20 87,20 87,11.3 | R6.2 92.79,11.3 92.79,9.6 | 74.22,17 v74.22,17.22 74.22,20
  Bottom 0.254: v62,15 v62,17.2
  Bottom 0.508: v74.22,17.22 74.22,14.6 C30.1
VGND
  pour Bottom (isolate 0.61): 0,100 100,100 100,0 0,0

### Text on the board
tPlace: MODE | SHUT | ISP | POWER | UP DOWN | SP | RST | SERIAL
Measures: BATT | ISP | SERIAL